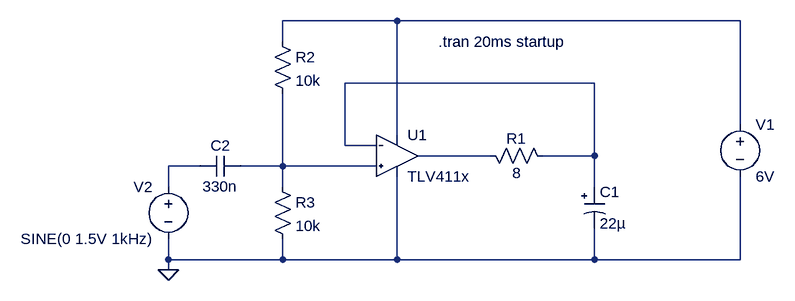
[diagram p0: schematic TLV411x-jig.asc]
TLV411x-jig.asc, the LTspice schematic file:
Version 4
SHEET 1 904 680
WIRE 112 -80 -64 -80
WIRE 640 -80 112 -80
WIRE -64 -48 -64 -80
WIRE 416 16 32 16
WIRE 640 80 640 -80
WIRE 112 96 112 -80
WIRE 32 112 32 16
WIRE 80 112 32 112
WIRE 256 128 144 128
WIRE 416 128 416 16
WIRE 416 128 336 128
WIRE -192 144 -240 144
WIRE -64 144 -64 32
WIRE -64 144 -128 144
WIRE 80 144 -64 144
WIRE -240 176 -240 144
WIRE -64 176 -64 144
WIRE 416 176 416 128
WIRE -240 288 -240 256
WIRE -64 288 -64 256
WIRE -64 288 -240 288
WIRE 112 288 112 160
WIRE 112 288 -64 288
WIRE 416 288 416 240
WIRE 416 288 112 288
WIRE 640 288 640 160
WIRE 640 288 416 288
WIRE -240 304 -240 288
FLAG -240 304 0
SYMBOL _PERSONAL\\opamps\\TLV411x 112 128 R0
SYMATTR InstName U1
SYMBOL voltage 640 64 R0
WINDOW 123 0 0 Left 0
WINDOW 39 0 0 Left 0
SYMATTR InstName V1
SYMATTR Value 6V
SYMBOL res 240 112 M90
WINDOW 0 5 56 VBottom 2
WINDOW 3 27 56 VTop 2
SYMATTR InstName R1
SYMATTR Value 8
SYMBOL polcap 400 176 R0
WINDOW 3 24 56 Left 2
SYMATTR Value 22µ
SYMATTR InstName C1
SYMATTR Description Capacitor
SYMATTR Type cap
SYMATTR SpiceLine V=35 Irms=160m Rser=0.75 Lser=0 mfg="Nichicon" pn="UPL1V220MAH" type="Al electrolytic"
SYMBOL voltage -240 160 M0
WINDOW 123 0 0 Left 0
WINDOW 39 0 0 Left 0
SYMATTR InstName V2
SYMATTR Value SINE(0 1.5V 1kHz)
SYMBOL res -80 -64 R0
SYMATTR InstName R2
SYMATTR Value 10k
SYMBOL res -80 160 R0
SYMATTR InstName R3
SYMATTR Value 10k
SYMBOL cap -192 128 M90
WINDOW 0 0 32 VBottom 2
WINDOW 3 32 32 VTop 2
SYMATTR InstName C2
SYMATTR Value 330n
TEXT 176 -48 Left 2 !.tran 20ms startup

The netlist it stands for:
* TLV411x-jig.asc
XU1 N005 N002 N001 0 N003 TLV411x  ; pins + - VCC VEE OUT
V1 N001 0 6V
R1 N003 N002 8
C1 N002 0 22µ V=35 Irms=160m Rser=0.75 Lser=0 mfg="Nichicon" pn="UPL1V220MAH" type="Al electrolytic"
V2 N004 0 SINE(0 1.5V 1kHz)
R2 N001 N005 10k
R3 N005 0 10k
C2 N004 N005 330n
.tran 20ms startup
.lib ..\sym\_PERSONAL\opamps\TLV411x.sub
.backanno
.end